# EAGLE design PA_PE_220_V301_RELE (EAGLE 5.04)
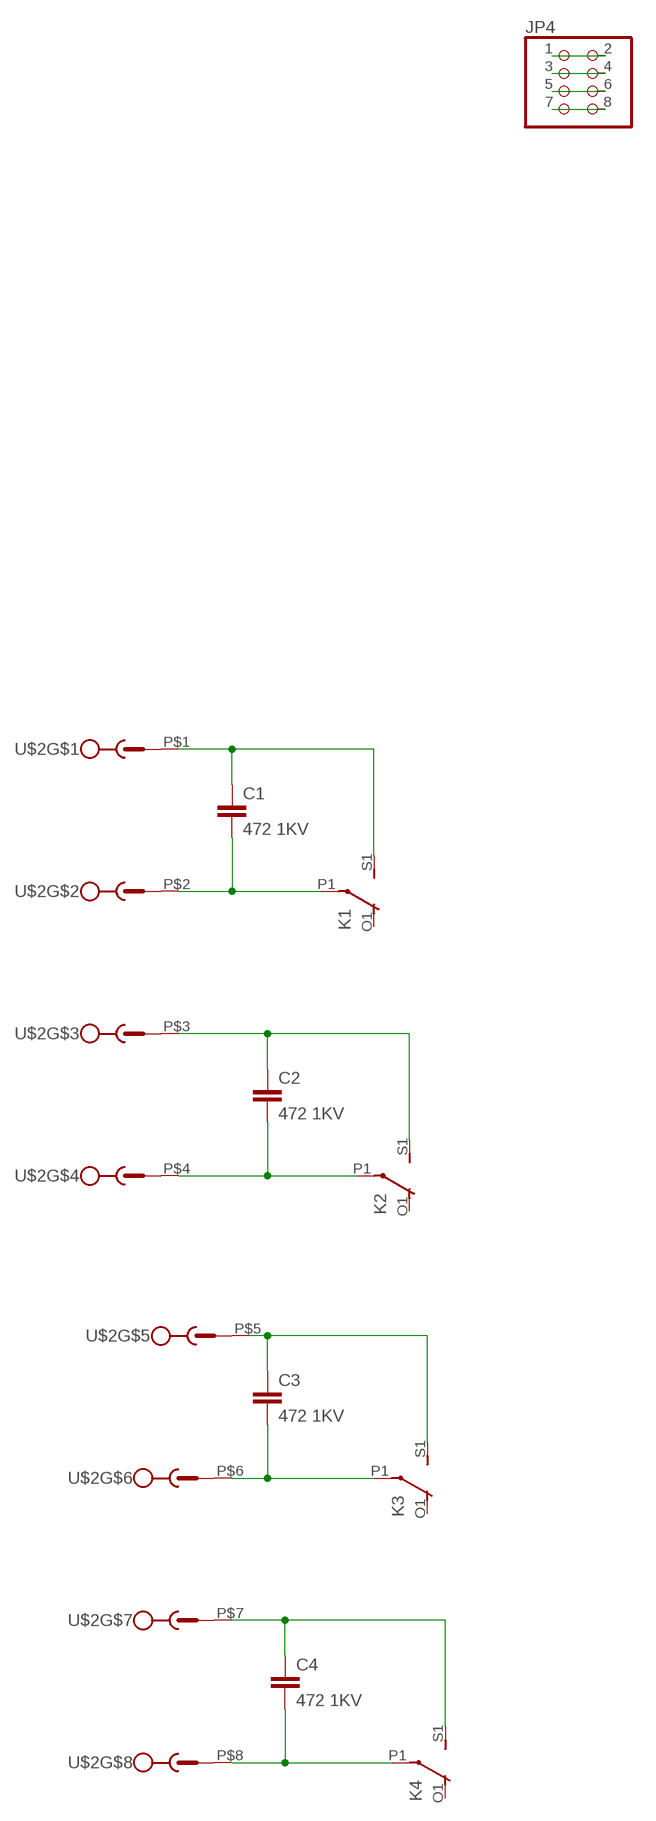
[diagram p0: schematic, sheet 1, part 1 of 2]
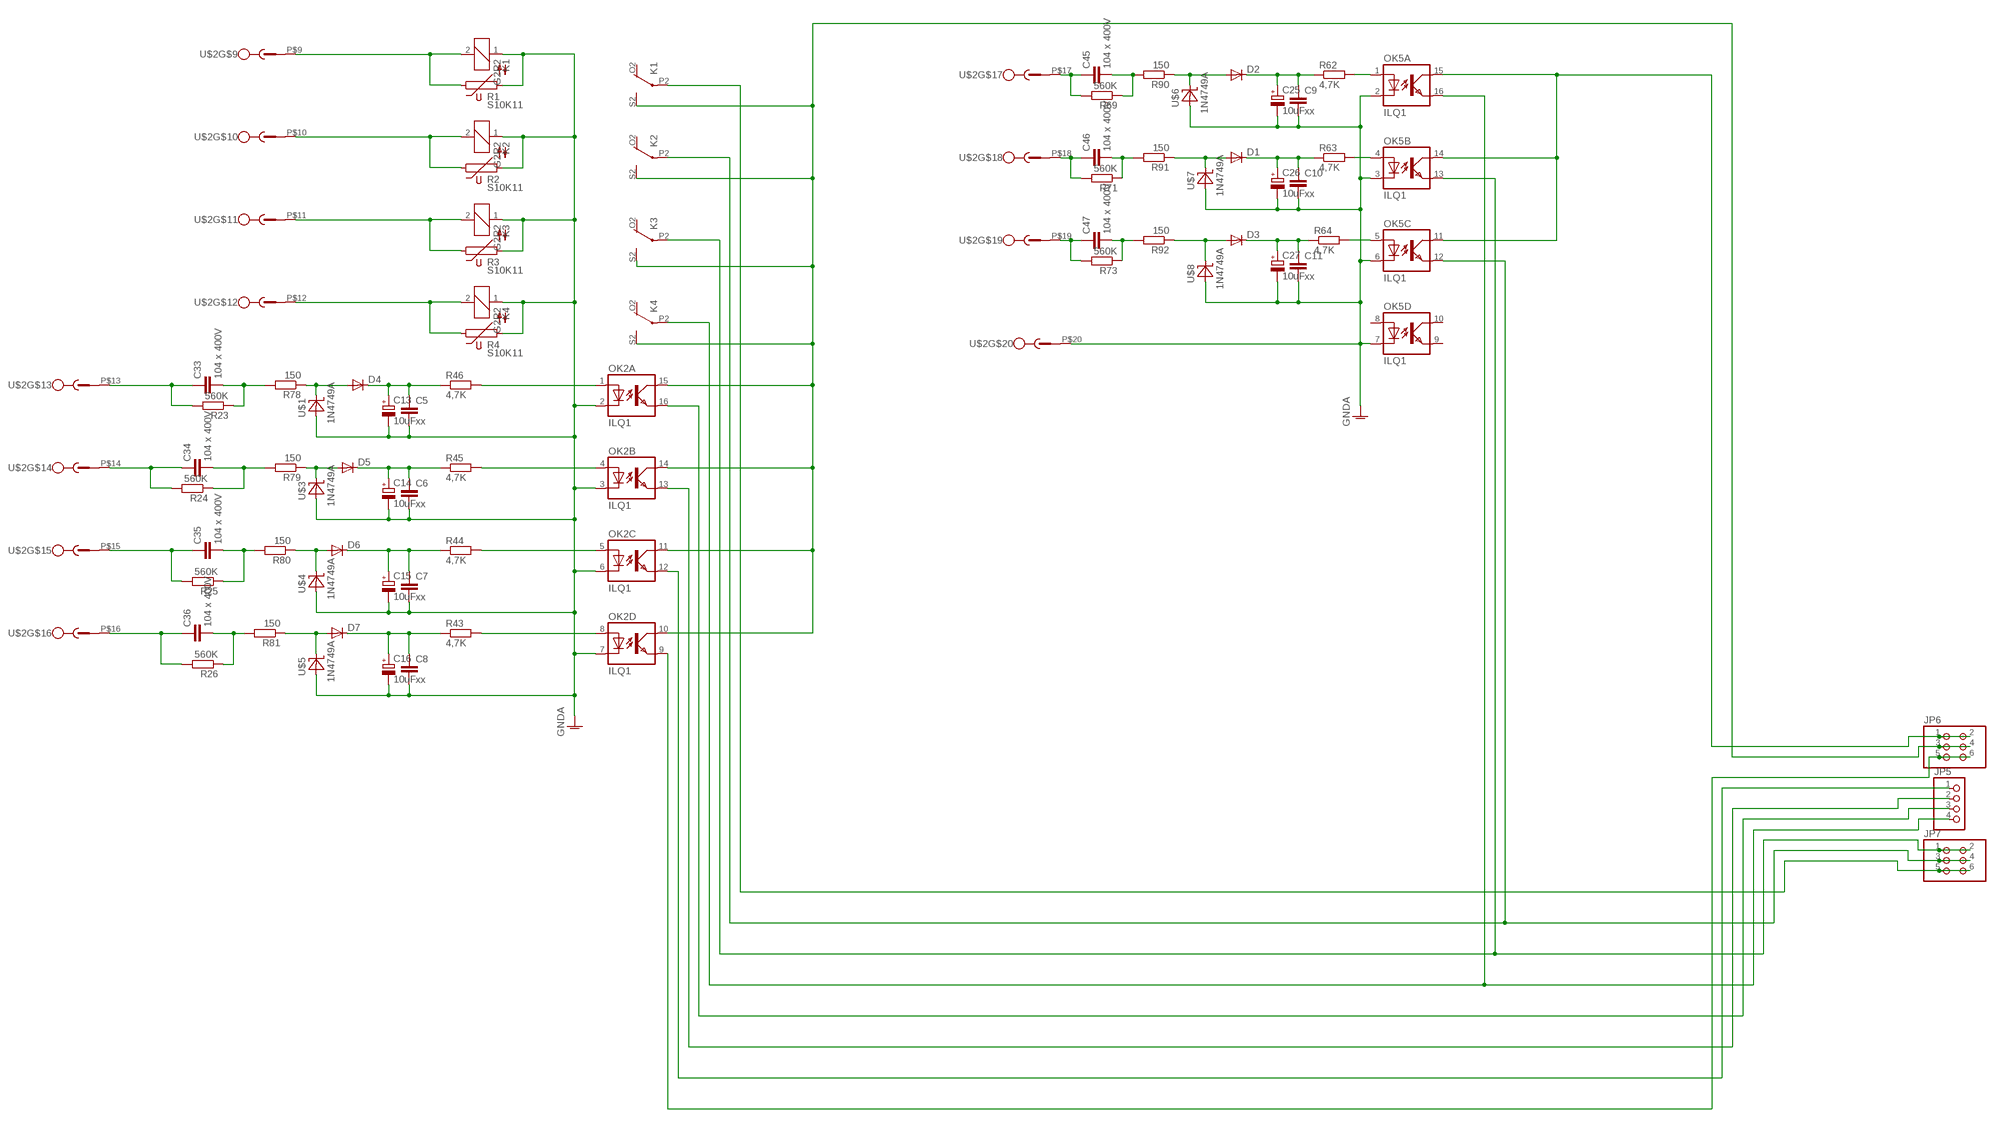
[diagram p1: schematic, sheet 1, part 2 of 2]

## Parts
C1  472 1KV  C-EU050-025X075  [C050-025X075]
C2  472 1KV  C-EU050-025X075  [C050-025X075]
C3  472 1KV  C-EU050-025X075  [C050-025X075]
C4  472 1KV  C-EU050-025X075  [C050-025X075]
C5  xx  C-EUC0805  [C0805]
C6  xx  C-EUC0805  [C0805]
C7  xx  C-EUC0805  [C0805]
C8  xx  C-EUC0805  [C0805]
C9  xx  C-EUC0805  [C0805]
C10  xx  C-EUC0805  [C0805]
C11  xx  C-EUC0805  [C0805]
C13  10uF  CPOL-EUE2.5-6  [E2,5-6]
C14  10uF  CPOL-EUE2.5-6  [E2,5-6]
C15  10uF  CPOL-EUE2.5-6  [E2,5-6]
C16  10uF  CPOL-EUE2.5-6  [E2,5-6]
C25  10uF  CPOL-EUE2.5-6  [E2,5-6]
C26  10uF  CPOL-EUE2.5-6  [E2,5-6]
C27  10uF  CPOL-EUE2.5-6  [E2,5-6]
C33  104 x 400V  C-EU150-054X183  [C150-054X183]
C34  104 x 400V  C-EU150-054X183  [C150-054X183]
C35  104 x 400V  C-EU150-054X183  [C150-054X183]
C36  104 x 400V  C-EU150-054X183  [C150-054X183]
C45  104 x 400V  C-EU150-054X183  [C150-054X183]
C46  104 x 400V  C-EU150-054X183  [C150-054X183]
C47  104 x 400V  C-EU150-054X183  [C150-054X183]
D1  DIODE-SOD123  [SOD123]
D2  DIODE-SOD123  [SOD123]
D3  DIODE-SOD123  [SOD123]
D4  DIODE-SOD123  [SOD123]
D5  DIODE-SOD123  [SOD123]
D6  DIODE-SOD123  [SOD123]
D7  DIODE-SOD123  [SOD123]
JP4  PINHD-2X4  [2X04]
JP5  PINHD-1X4  [1X04]
JP6  PINHD-2X3  [2X03]
JP7  PINHD-2X3  [2X03]
K1  G2R2  [G2R2]
K2  G2R2  [G2R2]
K3  G2R2  [G2R2]
K4  G2R2  [G2R2]
OK2  ILQ1  [DIL16]
OK5  ILQ1  [DIL16]
R1  S10K11  [S10K11]
R2  S10K11  [S10K11]
R3  S10K11  [S10K11]
R4  S10K11  [S10K11]
R23  560K  R-EU_0204/5  [0204/5]
R24  560K  R-EU_0204/5  [0204/5]
R25  560K  R-EU_0204/5  [0204/5]
R26  560K  R-EU_0204/5  [0204/5]
R43  4,7K  R-EU_M0805  [M0805]
R44  4,7K  R-EU_M0805  [M0805]
R45  4,7K  R-EU_M0805  [M0805]
R46  4,7K  R-EU_M0805  [M0805]
R62  4,7K  R-EU_M0805  [M0805]
R63  4,7K  R-EU_M0805  [M0805]
R64  4,7K  R-EU_M0805  [M0805]
R69  560K  R-EU_0204/5  [0204/5]
R71  560K  R-EU_0204/5  [0204/5]
R73  560K  R-EU_0204/5  [0204/5]
R78  150  R-EU_0207/10  [0207/10]
R79  150  R-EU_0207/10  [0207/10]
R80  150  R-EU_0207/10  [0207/10]
R81  150  R-EU_0207/10  [0207/10]
R90  150  R-EU_0207/10  [0207/10]
R91  150  R-EU_0207/10  [0207/10]
R92  150  R-EU_0207/10  [0207/10]
U$1  1N4749A  [DO41-7]
U$2  MC20_3.81  [MC_3.81]
U$3  1N4749A  [DO41-7]
U$4  1N4749A  [DO41-7]
U$5  1N4749A  [DO41-7]
U$6  1N4749A  [DO41-7]
U$7  1N4749A  [DO41-7]
U$8  1N4749A  [DO41-7]

## Nets
GNDA: C5.2 C6.2 C7.2 C8.2 C9.2 C10.2 C11.2 C13.- C14.- C15.- C16.- C25.- C26.- C27.- K1.1 K2.1 K3.1 K4.1 OK2.2(A:C) OK2.3(B:C) OK2.6(C:C) OK2.7(D:C) OK5.2(A:C) OK5.3(B:C) OK5.6(C:C) OK5.7(D:C) R1.2 R2.2 R3.2 R4.2 U$1.A U$2.P$20 U$3.A U$4.A U$5.A U$6.A U$7.A U$8.A
N$4: JP4.1 JP4.2
N$5: K1.2 R1.1 U$2.P$9
N$6: K2.2 R2.1 U$2.P$10
N$7: K3.2 R3.1 U$2.P$11
N$8: C34.1 R24.2 U$2.P$14
N$9: K4.2 R4.1 U$2.P$12
N$10: C1.2 K1.P1(2:P) U$2.P$2
N$11: C1.1 K1.S1(2:S) U$2.P$1
N$12: C2.2 K2.P1(2:P) U$2.P$4
N$13: C2.1 K2.S1(2:S) U$2.P$3
N$14: C3.2 K3.P1(2:P) U$2.P$6
N$15: C3.1 K3.S1(2:S) U$2.P$5
N$16: C4.2 K4.P1(2:P) U$2.P$8
N$17: C4.1 K4.S1(2:S) U$2.P$7
N$18: JP4.3 JP4.4
N$19: JP4.5 JP4.6
N$20: OK2.1(A:A) R46.2
N$21: OK2.4(B:A) R45.2
N$22: OK2.5(C:A) R44.2
N$23: OK2.8(D:A) R43.2
N$24: JP4.7 JP4.8
N$82: JP5.2 OK2.13(B:EMIT)
N$83: JP5.1 OK2.12(C:EMIT)
N$85: JP6.5 JP6.6 OK2.9(D:EMIT)
N$96: JP5.4 K4.P2(3:P) OK5.16(A:EMIT)
N$97: JP7.1 JP7.2 K3.P2(3:P) OK5.13(B:EMIT)
N$98: JP7.3 JP7.4 K2.P2(3:P) OK5.12(C:EMIT)
N$102: JP7.5 JP7.6 K1.P2(3:P)
N$112: JP5.3 OK2.16(A:EMIT)
N$165: D4.A R78.1 U$1.C
N$166: C5.1 C13.+ D4.C R46.1
N$167: C33.1 R23.2 U$2.P$13
N$168: C33.2 R23.1 R78.2
N$170: C34.2 R24.1 R79.2
N$171: D5.A R79.1 U$3.C
N$172: C6.1 C14.+ D5.C R45.1
N$173: C35.1 R25.2 U$2.P$15
N$174: C35.2 R25.1 R80.2
N$175: D6.A R80.1 U$4.C
N$176: C7.1 C15.+ D6.C R44.1
N$177: C36.1 R26.2 U$2.P$16
N$178: C36.2 R26.1 R81.2
N$179: D7.A R81.1 U$5.C
N$180: C8.1 C16.+ D7.C R43.1
N$184: JP6.1 JP6.2 OK5.11(C:COL) OK5.14(B:COL) OK5.15(A:COL)
N$185: JP6.3 JP6.4 K1.S2(3:S) K2.S2(3:S) K3.S2(3:S) K4.S2(3:S) OK2.10(D:COL) OK2.11(C:COL) OK2.14(B:COL) OK2.15(A:COL)
N$193: OK5.1(A:A) R62.2
N$196: OK5.4(B:A) R63.2
N$198: OK5.5(C:A) R64.2
N$208: C45.1 R69.2 U$2.P$17
N$209: C45.2 R69.1 R90.2
N$210: D2.A R90.1 U$6.C
N$211: C9.1 C25.+ D2.C R62.1
N$213: C46.1 R71.2 U$2.P$18
N$215: C46.2 R71.1 R91.2
N$216: D1.A R91.1 U$7.C
N$217: C10.1 C26.+ D1.C R63.1
N$218: C47.1 R73.2 U$2.P$19
N$219: C47.2 R73.1 R92.2
N$220: D3.A R92.1 U$8.C
N$221: C11.1 C27.+ D3.C R64.1
Unconnected: K1.O1(2:O) K1.O2(3:O) K2.O1(2:O) K2.O2(3:O) K3.O1(2:O) K3.O2(3:O) K4.O1(2:O) K4.O2(3:O) OK5.8(D:A) OK5.9(D:EMIT) OK5.10(D:COL)

## Library data of the parts
C1-C11 C33-C36 C45-C47 = rcl:C-EU: CAPACITOR, European symbol
C13-C16 C25-C27 = rcl:CPOL-EU: POLARIZED CAPACITOR, European symbol
D1-D7 = diode:DIODE-: DIODE
JP4 = pinhead:PINHD-2X4: PIN HEADER
JP5 = pinhead:PINHD-1X4: PIN HEADER
JP6 JP7 = pinhead:PINHD-2X3: PIN HEADER
K1-K4 = relay:G2R2: RELAY 2 x switch, Omron
OK2 OK5 = optocoupler:ILQ1: SIEMENS OPTO COUPLER
R1-R4 = varistor:S10K11: VARISTOR
R23-R26 R43-R46 R62-R64 R69 R71 R73 R78-R81 R90-R92 = rcl:R-EU_: RESISTOR, European symbol
U$1 U$3-U$8 = diode:1N4749A: Zener 24V 1W
U$2 = con-phoenix-381:MC20_3.81

## Board
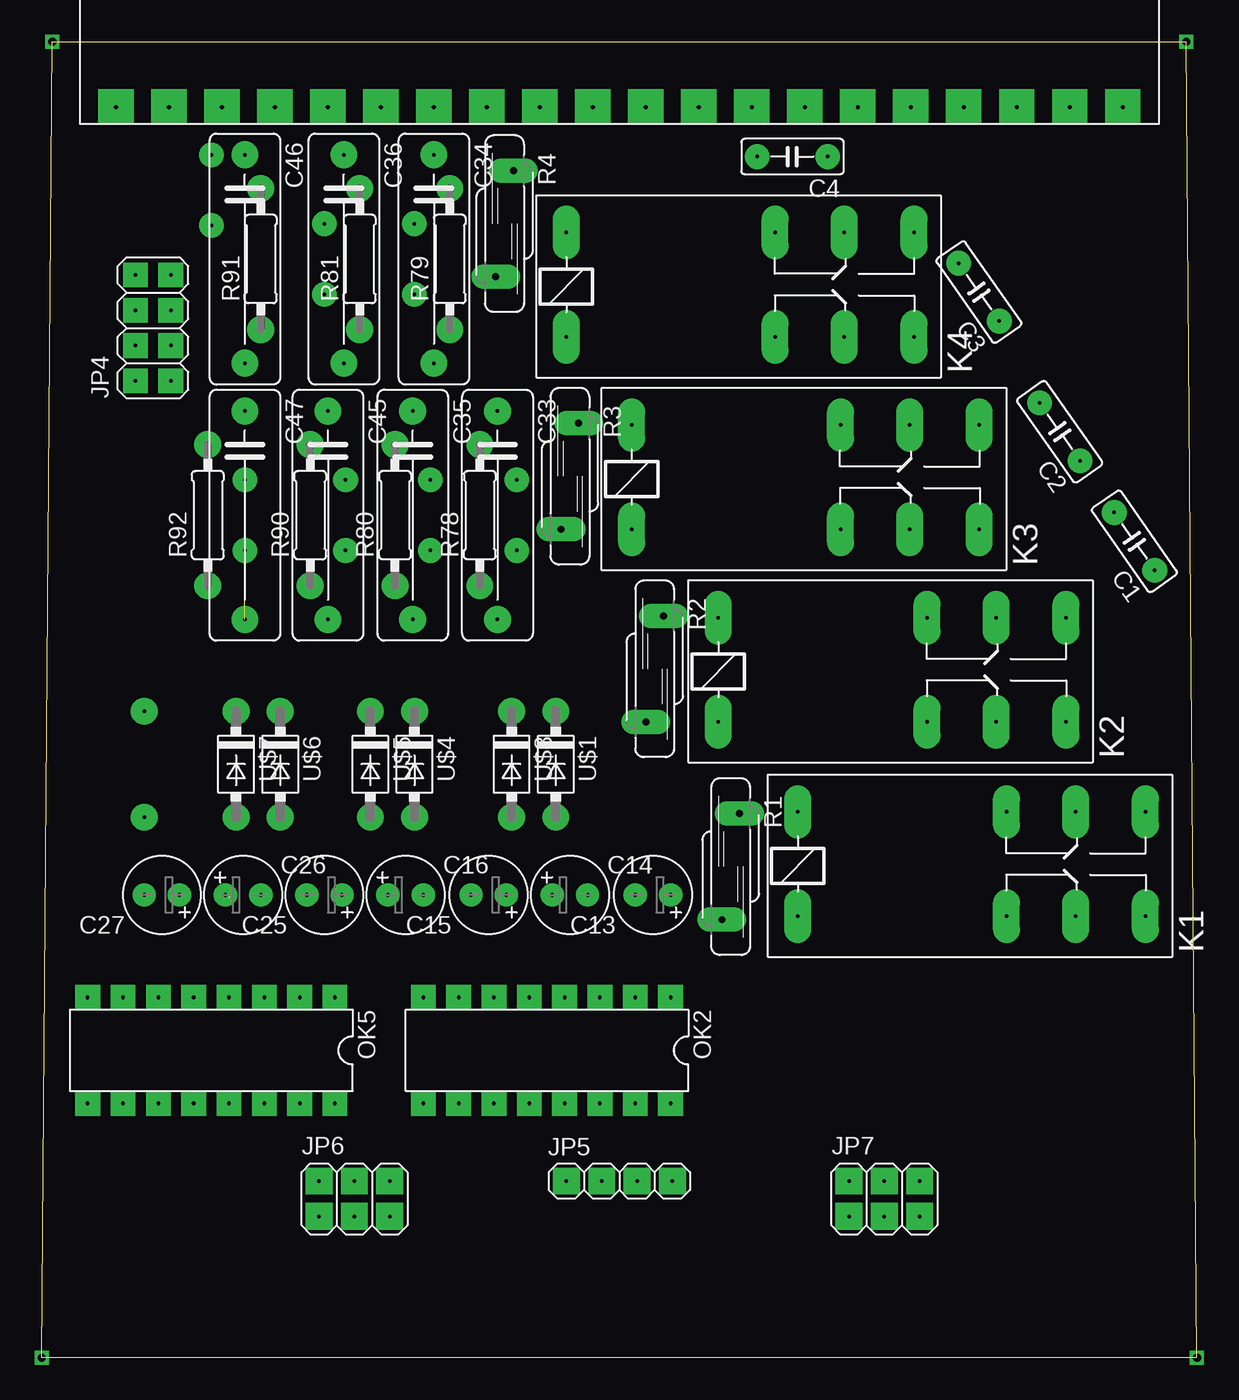
[diagram p2: board, top side]
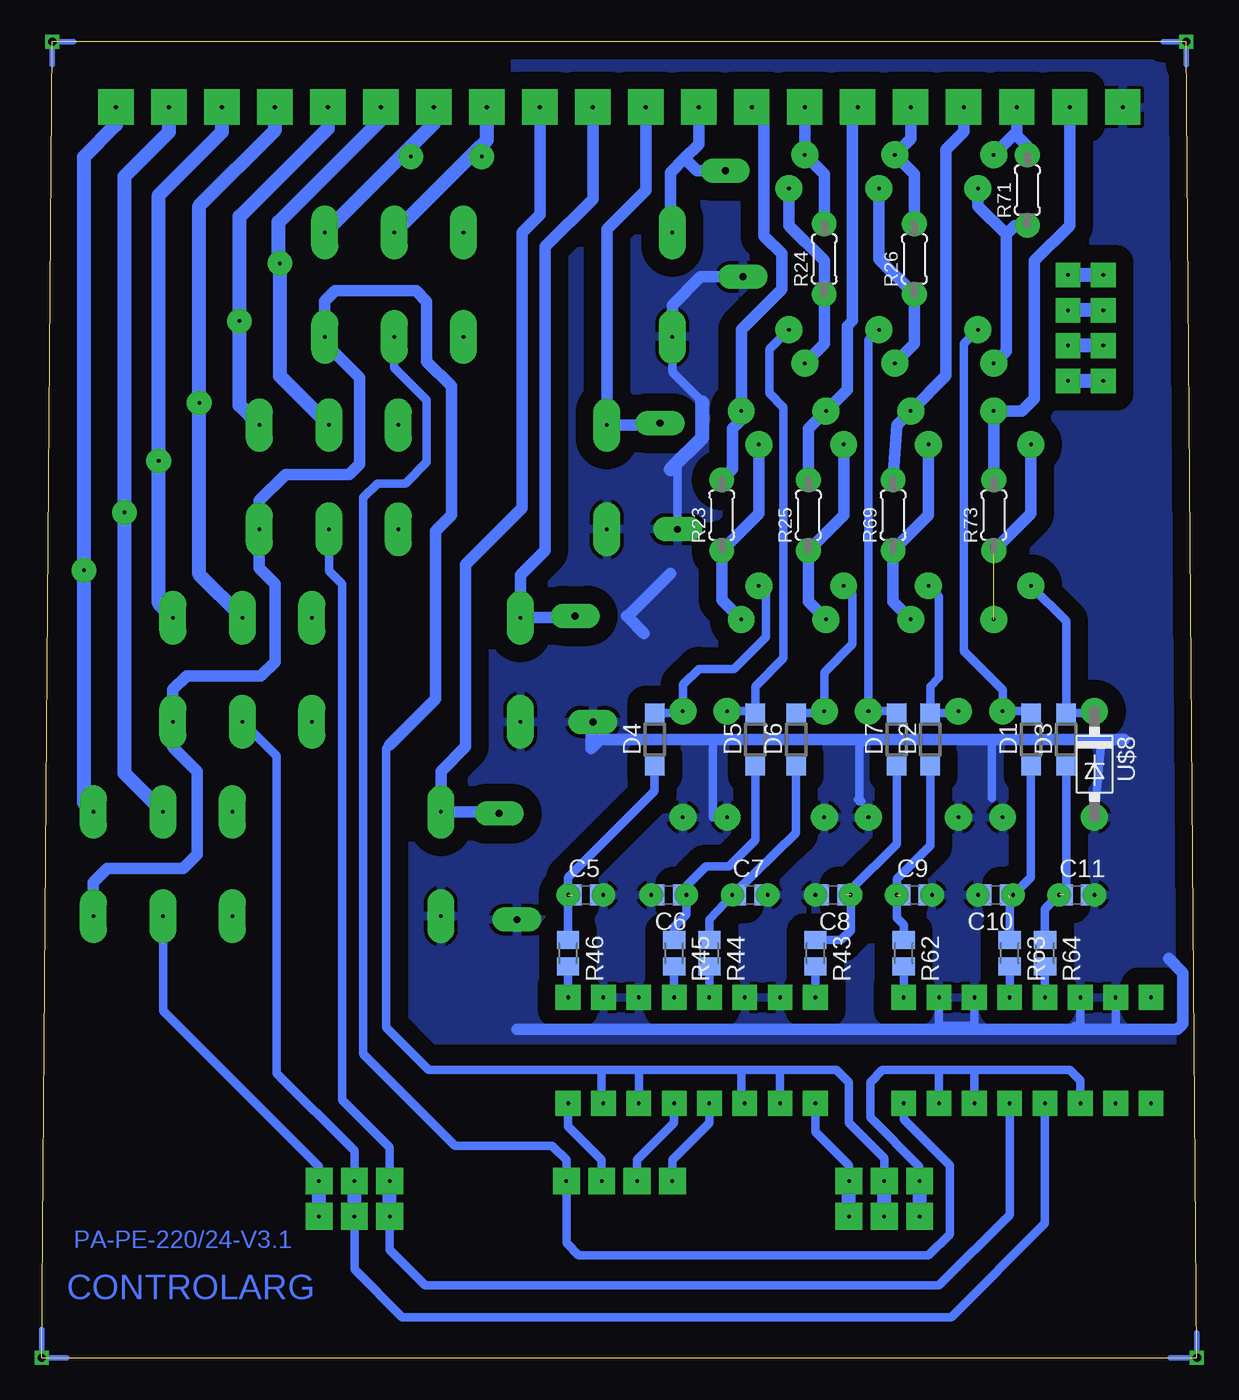
[diagram p3: board, bottom side, seen from below]

Size 83.06 x 94.62 mm. Coordinates in mm from the lower left corner, seen from the top.
Outline: 0,0 0.76,94.62 82.3,94.62 83.06,0 0,0
Copper layers (1*16): Top 0.035mm / dielectric 1.5mm / Bottom 0.035mm
Design rules "default *": minimum track width 10mil, minimum drill 24mil, track to track 8mil, track to pad 8mil, pad to pad 8mil, via to via 8mil, smd to smd 8mil, copper to edge 40mil, drill to drill 8mil, minimum pad ring 10mil, minimum via ring 8mil, stop-mask expansion 6mil, vias tented up to drill 0mil, thermal gap 10mil

### Footprints (pad centres in the part's own frame; a part is rotated, then mirrored left to right if it is on the bottom)
C050-025X075 = drill 0.254 pad 1.778 round: 1 -2.54,0; 2 2.54,0
C0805 = smd 1.3 x 1.5: 1 -0.95,0; 2 0.95,0
E2,5-6 = drill 0.254 pad 1.676 round: + -1.27,0; - 1.27,0
C150-054X183 = drill 0.254 pad 1.93 round: 1 -7.493,0; 2 7.493,0
SOD123 = smd 1.4 x 1.4: A 1.9,0; C -1.9,0
2X04 = drill 0.254 pad 1.778 square: 1 -3.81,-1.27; 2 -3.81,1.27; 3 -1.27,-1.27; 4 -1.27,1.27; 5 1.27,-1.27; 6 1.27,1.27; 7 3.81,-1.27; 8 3.81,1.27
1X04 = drill 0.254 pad 1.93 square: 1 -3.81,0; 2 -1.27,0; 3 1.27,0; 4 3.81,0
2X03 = drill 0.254 pad 1.93 square: 1 -2.54,-1.27; 2 -2.54,1.27; 3 0,-1.27; 4 0,1.27; 5 2.54,-1.27; 6 2.54,1.27
G2R2 = drill 0.254 pad 1.93 long: 1 -2.54,-3.683; 2 -2.54,3.81; O1 12.471,3.81; O2 12.471,-3.683; P1 17.45,3.81; P2 17.45,-3.683; S1 22.454,3.81; S2 22.454,-3.683
DIL16 = drill 0.254 pad 1.778 square: 1 -8.89,-3.81; 2 -6.35,-3.81; 3 -3.81,-3.81; 4 -1.27,-3.81; 5 1.27,-3.81; 6 3.81,-3.81; 7 6.35,-3.81; 8 8.89,-3.81; 9 8.89,3.81; 10 6.35,3.81; 11 3.81,3.81; 12 1.27,3.81; 13 -1.27,3.81; 14 -3.81,3.81; 15 -6.35,3.81; 16 -8.89,3.81
S10K11 = drill 0.5 pad 1.778 long: 1 -0.635,-3.81; 2 0.635,3.81
0204/5 = drill 0.254 pad 1.778 round: 1 -2.54,0; 2 2.54,0
M0805 = smd 1.3 x 1.6: 1 -0.95,0; 2 0.95,0
0207/10 = drill 0.254 pad 1.93 round: 1 -5.08,0; 2 5.08,0
DO41-7 = drill 0.254 pad 1.93 round: A 3.81,0; C -3.81,0
MC_3.81 = drill 0.305 pad 2.54 square: P$1 -36.195,0; P$2 -32.385,0; P$3 -28.575,0; P$4 -24.765,0; P$5 -20.955,0; P$6 -17.145,0; P$7 -13.335,0; P$8 -9.525,0; P$9 -5.715,0; P$10 -1.905,0; P$11 1.905,0; P$12 5.715,0; P$13 9.525,0; P$14 13.335,0; P$15 17.145,0; P$16 20.955,0; P$17 24.765,0; P$18 28.575,0; P$19 32.385,0; P$20 36.195,0

### Placement (x,y rotation side)
C1  78.57,58.69 125 top
C2  73.19,66.57 125 top
C3  67.39,76.61 125 top
C4  53.98,86.36 180 top
C5  43.94,33.27 0 bottom
C6  37.97,33.27 180 bottom
C7  32.13,33.27 0 bottom
C8  26.16,33.27 180 bottom
C9  20.32,33.27 0 bottom
C10  14.48,33.27 180 bottom
C11  8.64,33.27 0 bottom
C13  43.94,33.27 180 top
C14  37.97,33.27 0 top
C15  32.13,33.27 180 top
C16  26.16,33.27 0 top
C25  20.32,33.27 180 top
C26  14.48,33.27 0 top
C27  8.64,33.27 180 top
C33  32.77,60.58 270 top
C34  28.19,78.99 270 top
C35  26.67,60.58 270 top
C36  21.72,78.99 270 top
C45  20.57,60.58 270 top
C46  14.61,78.99 270 top
C47  14.61,60.58 270 top
D1  11.94,44.45 90 bottom
D2  19.18,44.45 90 bottom
D3  9.4,44.45 90 bottom
D4  38.99,44.45 90 bottom
D5  31.75,44.45 90 bottom
D6  28.83,44.45 90 bottom
D7  21.59,44.45 90 bottom
JP4  8,74.04 90 top
JP5  41.53,12.7 0 top
JP6  22.48,11.43 0 top
JP7  60.58,11.43 0 top
K1  56.9,35.43 0 top
K2  51.18,49.4 0 top
K3  44.96,63.25 0 top
K4  40.26,77.09 0 top
OK2  36.32,22.1 180 top
OK5  12.19,22.1 180 top
R1  49.53,35.31 180 top
R2  44.07,49.53 180 top
R3  37.97,63.37 180 top
R4  33.27,81.53 180 top
R23  34.16,60.58 90 bottom
R24  26.8,78.99 90 bottom
R25  27.94,60.58 90 bottom
R26  20.32,78.99 90 bottom
R43  27.43,29.08 270 bottom
R44  35.05,29.08 270 bottom
R45  37.59,29.08 270 bottom
R46  45.21,29.08 270 bottom
R62  21.08,29.08 270 bottom
R63  13.46,29.08 270 bottom
R64  10.92,29.08 270 bottom
R69  21.84,60.58 90 bottom
R71  12.19,83.95 90 bottom
R73  14.61,60.58 90 bottom
R78  31.5,60.58 90 top
R79  29.34,78.99 90 top
R80  25.4,60.58 90 top
R81  22.86,78.99 90 top
R90  19.3,60.58 90 top
R91  15.75,78.99 90 top
R92  11.94,60.58 90 top
U$1  36.96,42.67 270 top
U$2  41.53,89.92 180 top
U$3  33.78,42.67 270 top
U$4  26.8,42.67 270 top
U$5  23.62,42.67 270 top
U$6  17.14,42.67 270 top
U$7  13.97,42.67 270 top
U$8  7.37,42.67 270 bottom

### Tracks (layer width: path | path; a pad name or v marks a point on that pad's centre or on a via)
GNDA
  Bottom 0.61: 14.73,44.45 14.73,40.26 | 23.88,44.45 24.26,44.07 24.26,40.13 | 24.26,40.13 24.26,40 24.13,40 | 24.26,40.13 24.38,40.13 | 5.84,23.88 OK5.7 | OK5.6 8.38,23.88 8.76,23.88 | OK5.3 16,23.88 18.54,23.88 OK5.2 | U$8.A 6.86,44.32 6.1,44.45 | R3.2 37.34,64.64 | 35.56,68.71 37.72,70.87 K4.1 | U$3.A 34.8,38.86 34.8,44.45
  Bottom 0.813: 5.21,44.45 6.1,44.45 14.73,44.45 23.88,44.45 34.8,44.45 42.93,44.45 43.56,43.81 43.56,45.59 R2.2 | 39.75,52.07 40.96,53.28 | 40.96,53.28 41.02,53.34 | 40.96,53.28 37.85,56.39 | 37.59,73.28 K4.1 37.72,75.69 35.69,77.72 R4.2 | 48.9,23.62 1.4,23.62 1.02,24 1.02,27.69 2.03,28.7
  Bottom 1.016: 35.56,68.71 35.56,66.17 37.85,63.88
  pour Bottom (isolate 1.27): 0.25,22.86 56.77,22.86 56.77,43.18 52.96,46.99 52.96,57.02 48.77,61.21 49.02,94.23 0.76,94.62 0.25,23.11
N$1  (via drill 0.6)
  other vias: 83.06,0
N$2  (via drill 0.6)
  other vias: 82.3,94.62
N$3  (via drill 0.6)
  other vias: 0.76,94.62
N$4
  Bottom 1.016: JP4.2 JP4.1
N$5
  Bottom 0.813: U$2.P$9 47.24,82.17 48.51,80.9 48.51,61.09 52.58,57.02 52.58,43.94 54.36,42.16 K1.2 50.29,39.24 R1.1
N$6
  Bottom 0.813: U$2.P$10 43.43,83.31 46.86,79.88 46.86,58.04 48.64,56.26 K2.2 44.83,53.21 R2.1
N$7
  Bottom 0.813: U$2.P$11 39.62,83.95 42.42,81.15 K3.2 38.73,67.06 R3.1
N$8
  Bottom 0.813: U$2.P$14 C34.1 26.8,85.09 R24.2
N$9
  Bottom 0.813: U$2.P$12 35.81,87.25 36.83,86.23 | 36.83,86.23 37.85,85.22 37.85,81.03 K4.2 | R4.1 35.94,85.34 36.83,86.23
N$10
  Bottom 1.016: U$2.P$2 73.91,88.14 77.11,84.94 C1.2 77.11,42.01 K1.P1
N$11
  Bottom 1.016: K1.S1 80.02,39.92 C1.1 80.02,86.35 77.72,88.65 U$2.P$1
N$12
  Bottom 1.016: U$2.P$4 66.29,88.27 71.74,82.82 C2.2 71.74,56.32 K2.P1
N$13
  Bottom 1.016: U$2.P$3 70.1,88.14 74.65,83.59 C2.1 74.65,54.23 K2.S1
N$14
  Bottom 1.016: U$2.P$6 58.67,89.03 66.04,81.66 66.04,78.8 C3.2 65.93,70.58 K3.P1
N$15
  Bottom 1.016: U$2.P$5 62.48,88.39 68.83,82.04 C3.1 68.84,68.49 K3.S1
N$16
  Bottom 1.016: 51.84,86.77 K4.P1 | 51.84,86.77 51.05,87.55 U$2.P$8 | C4.2 51.84,86.77
N$17
  Bottom 1.016: 56.76,86.86 54.86,88.75 U$2.P$7 | 56.76,86.86 K4.S1 | C4.1 56.76,86.6 56.76,86.86
N$18
  Bottom 1.016: JP4.4 JP4.3
N$19
  Bottom 1.016: JP4.6 JP4.5
N$20
  Bottom 0.61: OK2.1 R46.2
N$21
  Bottom 0.61: OK2.4 R45.2
N$22
  Bottom 0.61: OK2.5 R44.2
N$23
  Bottom 0.61: OK2.8 R43.2
N$24
  Bottom 1.016: JP4.8 JP4.7
N$69
  Bottom 0.406: 2.41,94.62 0.76,94.62 0.76,92.96
N$71
  Bottom 0.406: 80.77,94.62 82.3,94.62 82.3,93.47
N$82
  Bottom 0.61: OK2.13 37.59,16.89 40.26,14.22 JP5.2
N$83
  Bottom 0.61: OK2.12 35.05,16.89 37.72,14.22 JP5.1
N$85
  Bottom 0.61: OK2.9 27.43,16.26 25.02,13.84 JP6.6
  Bottom 1.016: JP6.5 JP6.6
N$96
  Bottom 0.61: K4.P2 57.71,71.17 55.37,68.83 55.37,64.39 56.9,62.87 58.93,62.87 59.94,61.85 59.94,21.84 53.53,15.43 53.34,15.24 46.36,15.24 45.34,14.22 JP5.4 45.34,8.25 44.45,7.37 19.3,7.37 17.78,8.89 17.78,13.84 21.08,17.14 OK5.16
N$97
  Bottom 0.61: K3.P2 62.41,56.57 61.47,55.63 61.47,18.54 58.04,15.11 JP7.2 | OK5.13 13.46,10.29 18.54,5.21 55.5,5.21 58.04,7.75 JP7.1
  Bottom 1.016: JP7.1 JP7.2
N$98
  Bottom 0.61: K2.P2 66.17,43.26 66.17,20.45 60.58,14.86 JP7.4 | OK5.12 10.92,9.65 17.65,2.92 57.15,2.92 60.58,6.35 JP7.3
  Bottom 1.016: JP7.3 JP7.4
N$102
  Bottom 0.61: K1.P2 74.35,24.94 63.12,13.72 JP7.6
  Bottom 1.016: JP7.5 JP7.6
N$112
  Bottom 0.61: JP5.3 42.8,14.22 45.21,16.64 OK2.16
N$119
  Bottom 0.406: 83.06,1.02 83.06,0 81.28,0
N$147
  Bottom 0.406: 83.06,0 83.06,2.03
N$150
  Bottom 0.406: 82.3,92.96 82.3,94.62
N$153  (via drill 0.6)
  Bottom 0.406: 0,1.78 v0,0 1.9,0
N$165
  Bottom 0.61: D4.A 36.58,46.35 U$1.C 36.96,48.39 35.81,49.53 33.27,49.53 30.99,51.82 30.99,54.99 R78.1
N$166  (1 unrouted)
  Bottom 0.61: R46.1 C13.+ 45.21,34.54 38.99,40.77 D4.C
N$167
  Bottom 0.61: 31.12,88.65 U$2.P$13
  Bottom 0.813: 31.12,88.65 31.12,80.64 29.84,79.38 29.84,76.84 32.77,73.91 C33.1 32.77,67.44 33.4,66.8 33.4,63.88 R23.2
N$168
  Bottom 0.813: R78.2 31.5,60.71 R23.1 34.16,54.48 C33.2
N$170
  Bottom 0.813: R79.2 29.34,81.41 26.8,78.87 R24.1 26.8,72.9 C34.2
N$171
  Bottom 0.61: R79.1 30.73,72.52 30.73,69.34 29.72,68.33 29.72,50.29 31.75,48.26 D5.A 31.88,46.48 U$3.C
N$172
  Bottom 0.61: R45.1 37.59,30.99 36.7,31.88 C14.+ | 36.2,34.42 36.7,33.91 C14.+ | 36.2,34.42 35.81,34.8 | D5.C 31.75,37.21 33.66,35.31 35.31,35.31 36.2,34.42 | C14.+ C6.1
N$173
  Bottom 0.813: U$2.P$15 24.77,89.15 24.77,74.55 25.15,74.17 25.15,69.6 C35.1 27.94,66.8 R25.2
N$174
  Bottom 0.813: C35.2 27.94,54.36 R25.1 25.4,60.58 R80.2
N$175
  Bottom 0.61: D6.A 26.68,46.35 U$4.C 26.8,49.28 24.77,51.31 24.77,54.86 R80.1
N$176
  Bottom 0.61: R44.1 35.05,31.5 C15.+ | C15.+ 28.83,37.72 D6.C | C15.+ C7.1
N$177
  Bottom 0.813: U$2.P$16 20.57,87.63 C36.1 20.32,85.09 R26.2
N$178
  Bottom 0.813: C36.2 20.32,72.9 R26.1 22.86,78.99 R81.2
N$179
  Bottom 0.61: R81.1 23.62,73.15 U$5.C 21.72,46.48 arc90 D7.A
N$180  (1 unrouted)
  Bottom 0.61: 27.37,30.1 R43.1 25.59,30.03 24.89,30.73 C16.+ 24.89,33.66 21.59,36.96 D7.C
N$184
  Bottom 0.61: OK5.11 8.38,19.94 9.14,20.7 16,20.7 | 16,20.7 OK5.14 | 16,20.7 18.67,20.7 | OK5.15 18.54,20.57 18.67,20.7 | 18.67,20.7 22.61,20.7 23.5,19.81 23.5,17.27 19.94,13.72 JP6.2
  Bottom 1.016: JP6.2 JP6.1
N$185
  Bottom 0.61: 58.04,44.07 58.29,43.81 58.29,23.75 56.01,21.46 | 56.01,21.46 55.75,21.21 | 29.97,20.7 25.91,20.7 25.02,19.81 25.02,16.89 22.48,14.35 JP6.4 | 29.97,20.7 32.77,20.7 | 32.77,20.7 40.13,20.7 | 40.13,20.7 OK2.14 | 29.97,20.7 OK2.10 | OK2.11 32.77,18.54 32.77,20.7 | 40.13,20.7 42.8,20.7 | OK2.15 42.8,18.42 42.8,20.7 | 42.8,20.7 55.24,20.7 56.01,21.46
  Bottom 0.813: K1.S2 79.35,34.19 78.36,35.18 72.9,35.18 71.88,36.19 71.88,42.16 73.63,43.92 K2.S2 73.63,48.03 72.64,49.02 67.31,49.02 66.29,50.04 66.29,55.63 67.44,56.77 67.44,59.54 K3.S2 67.41,61.62 65.53,63.5 60.96,63.5 60.2,64.26 60.2,70.48 62.71,73 K4.S2 62.71,75.97 61.98,76.71 56.13,76.71 55.37,75.95 55.37,71.63 53.59,69.85 53.59,60.58 54.74,59.44 54.74,47.37 58.04,44.07
  Bottom 1.016: JP6.3 JP6.4
N$193
  Bottom 0.61: OK5.1 R62.2
N$196
  Bottom 0.61: OK5.4 R63.2
N$198
  Bottom 0.61: OK5.5 R64.2
N$208
  Bottom 0.813: U$2.P$17 16.76,88.14 18.03,86.87 18.03,70.61 C45.1 21.59,67.06 R69.2
N$209
  Bottom 0.813: R90.2 19.3,60.58 R69.1 21.84,54.36 C45.2
N$210
  Bottom 0.61: R90.1 18.54,54.74 18.54,48.89 19.18,48.26 D2.A 17.14,46.35 U$6.C
N$211  (1 unrouted)
  Bottom 0.61: D2.C 19.18,36.83 21.59,34.42 C25.+ 21.59,31.62 21.08,31.11 R62.1
N$213
  Bottom 0.813: U$2.P$18 12.95,88.14 13.08,88.01 | 13.08,88.01 C46.1 | R71.2 12.19,87.12 13.08,88.01
N$215
  Bottom 0.813: C46.2 13.72,72.39 13.72,80.77 | R71.1 13.08,81.41 13.72,80.77 | R91.2 15.75,82.8 13.72,80.77
N$216
  Bottom 0.61: R91.1 16.76,72.9 16.76,50.8 13.97,48.01 U$7.C 11.94,46.48 D1.A
N$217  (1 unrouted)
  Bottom 0.61: D1.C 11.94,34.54 C26.+ 13.46,33.02 R63.1
N$218
  Bottom 0.813: U$2.P$19 9.14,81.41 11.68,78.87 11.68,68.96 12.57,68.07 C47.1 R73.2
N$219  (1 unrouted)
  Bottom 0.813: R73.1 11.94,60.71 R92.2
N$220
  Bottom 0.61: R92.1 9.4,52.96 D3.A 7.37,46.35 U$8.C
N$221  (1 unrouted)
  Bottom 0.61: R64.1 10.92,32.26 C27.+ 9.4,33.78 D3.C

### Text on the board
Bottom: PA-PE-220/24-V3.1 | CONTROLARG